# Altium schematic sheet [1] AMS_Input_Stage.SchDoc
size A3
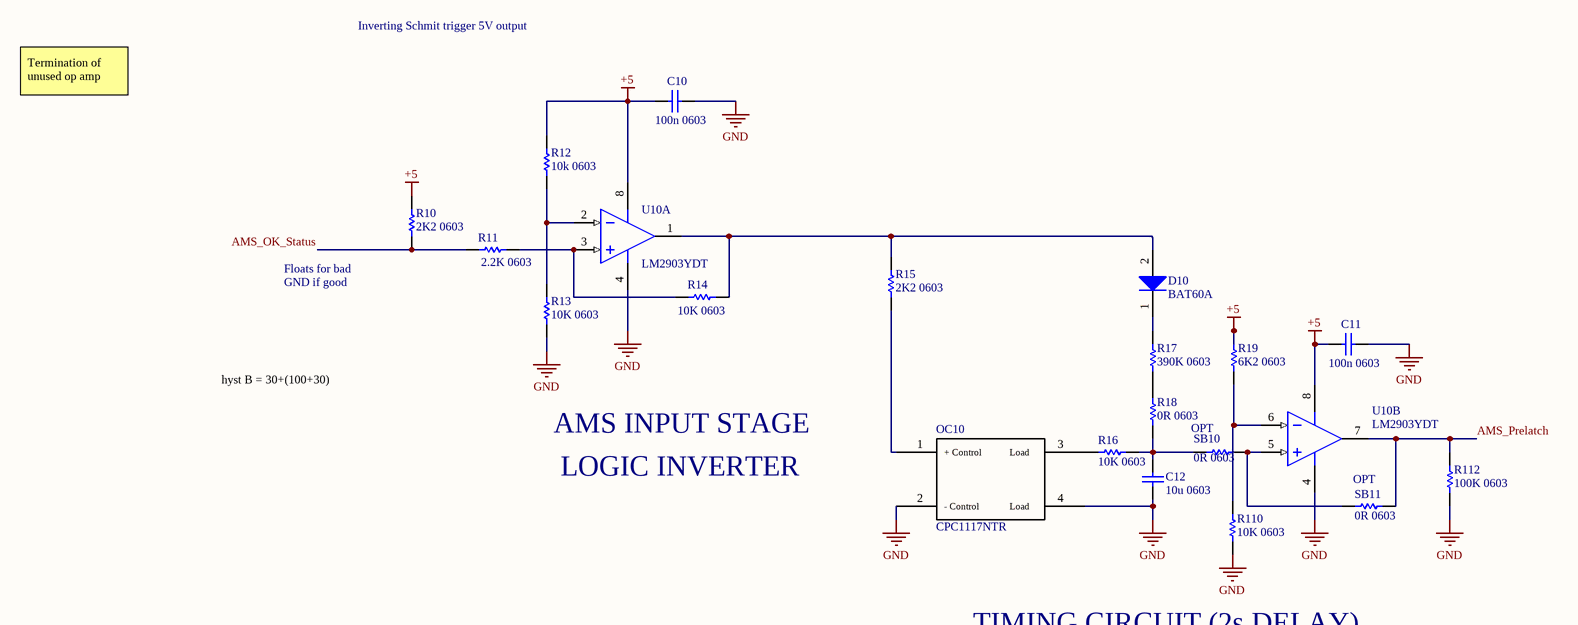
[diagram p0: [1] AMS_Input_Stage.SchDoc]

## Parts
C10  100n 0603  [CAPC0603(1608)100_M]
C11  100n 0603  [CAPC0603(1608)100_M]
C12  10u 0603  [CAPC0603(1608)100_M]
D10  BAT60A  [INF-SOD323_V]
OC10  CPC1117NTR  [SOP-4 (CPC1117NTR)]
R10  2K2 0603  [CAPC0603(1608)100_M]
R11  2.2K 0603  [CAPC0603(1608)100_M]
R12  10k 0603  [CAPC0603(1608)100_M]
R13  10K 0603  [CAPC0603(1608)100_M]
R14  10K 0603  [CAPC0603(1608)100_M]
R15  2K2 0603  [CAPC0603(1608)100_M]
R16  10K 0603  [CAPC0603(1608)100_M]
R17  390K 0603  [CAPC0603(1608)100_M]
R18  0R 0603  [CAPC0603(1608)100_M]
R19  6K2 0603  [CAPC0603(1608)100_M]
R110  10K 0603  [CAPC0603(1608)100_M]
R112  100K 0603  [CAPC0603(1608)100_M]
SB10  0R 0603  [CAPC0603(1608)100_M]
SB11  0R 0603  [CAPC0603(1608)100_M]
U10  LM2903YDT  [ONSC-SOIC-8-751-07_V]  (parts A,B of 2)

## Nets
+5: C10.1 C11.1 R10.1 R12.2 R19.1 U10.8(VCC)
GND: C10.2 C11.2 C12.2 OC10.2 OC10.4 R13.1 R110.2 R112.2 U10.4(GND)
AMS_OK_Status: R10.2 R11.1
AMS_Prelatch: R112.1 SB11.2 U10.7(OUTB)
NetC12_1: C12.1 R16.2 R18.2 SB10.1
NetD10_1: D10.1(K) R17.1
NetD10_2: D10.2(A) R14.2 R15.1 U10.1(OUTA)
NetOC10_1: OC10.1 R15.2
NetOC10_3: OC10.3 R16.1
NetR11_2: R11.2 R14.1 U10.3(INA+)
NetR12_1: R12.1 R13.2 U10.2(INA-)
NetR17_2: R17.2 R18.1
NetR19_2: R19.2 R110.1 U10.6(INB-)
NetSB10_2: SB10.2 SB11.1 U10.5(INB+)

## Notes on the sheet
- Inverting Schmit trigger 5V output
- Termination of unused op amp
- (near R10) Floats for bad
- GND if good
- hyst B = 30+(100+30)
- LOGIC INVERTER
- AMS INPUT STAGE
- (near SB10) OPT
- OPT
- TIMING CIRCUIT (2s DELAY)
- (in symbol CPC1117NTR) + Control; Load; - Control

## Library data of the parts
C10 C11 = Cap: Capacitor; Value: 100nF; Published: 8-Jun-2000; LatestRevisionDate: 17-Jul-2002; LatestRevisionNote: Re-released for DXP Platform.; PackageReference: RAD-0.3; Publisher: Altium Limited; PackageDescription: Radial Cap, Thru-Hole; 2 Leads; 0.3 in Pin Spacing
C12 = Cap: Capacitor; Value: 10uF; Published: 8-Jun-2000; LatestRevisionDate: 17-Jul-2002; LatestRevisionNote: Re-released for DXP Platform.; PackageReference: RAD-0.3; Publisher: Altium Limited; PackageDescription: Radial Cap, Thru-Hole; 2 Leads; 0.3 in Pin Spacing
D10 = CMP-1183-00008-2: Silicon Schottky Diode, -55 to 85 degC, SOD323, Reel, Green; Manufacturer: Infineon; Green: TRUE; VR (max): 10Â V; IF (max): 3,000Â mA; VF (max): 370Â mV; CT (max): 35Â pF; Configuration: Single; PackageDescription: 3-Pin Small Outline Transistor Package, 1.25 x 2 mm Body, 0.65 mm Pitch; PartNumber: BAT60A; Mounting Technology: Surface Mount; PackageReference: SOT323; ComponentLink1Description: Manufacturer URL; Packing: Reel; ComponentLink3URL: http://www.infineon.com/dgdl/SOT323-Package_Overview.pdf?folderId=db3a30431936bc4b0119533e1dcb3c92&fileId=db3a30431936bc4b011953495f283cb1; ComponentLink2URL: http://www.infineon.com/dgdl/bat60aseries.pdf?folderId=db3a304313d846880113def5812204a1&fileId=db3a304313d846880113def70c9304a9; ComponentLink1URL: http://www.infineon.com/; ComponentLink2Description: Datasheet; ComponentLink3Description: Package Specification
R10 R13 R15-R19 R110 R112 = Res1: Resistor; Published: 8-Jun-2000; LatestRevisionDate: 17-Jul-2002; LatestRevisionNote: Re-released for DXP Platform.; PackageReference: AXIAL-0.3; Publisher: Altium Limited; PackageDescription: Axial Device, Thru-Hole; 2 Leads; 0.3 in Pin Spacing
  R10 R15: Value: 2K2
  R13 R16 R110: Value: 10K
  R17: Value: 390K
  R18: Value: 0R
  R19: Value: 6K2
  R112: Value: 100K
R11 = Res1: Resistor; Value: 10K; Published: 8-Jun-2000; LatestRevisionDate: 17-Jul-2002; LatestRevisionNote: Re-released for DXP Platform.; PackageReference: AXIAL-0.3; Publisher: Altium Limited; PackageDescription: Axial Device, Thru-Hole; 2 Leads; 0.3 in Pin Spacing
R12 = Res1: Resistor; Value: 6K2; Published: 8-Jun-2000; LatestRevisionDate: 17-Jul-2002; LatestRevisionNote: Re-released for DXP Platform.; PackageReference: AXIAL-0.3; Publisher: Altium Limited; PackageDescription: Axial Device, Thru-Hole; 2 Leads; 0.3 in Pin Spacing
R14 = Res1: Resistor; Value: 100K; Published: 8-Jun-2000; LatestRevisionDate: 17-Jul-2002; LatestRevisionNote: Re-released for DXP Platform.; PackageReference: AXIAL-0.3; Publisher: Altium Limited; PackageDescription: Axial Device, Thru-Hole; 2 Leads; 0.3 in Pin Spacing
SB10 SB11 = Res1: Resistor; Value: Bridge; Published: 8-Jun-2000; LatestRevisionDate: 17-Jul-2002; LatestRevisionNote: Re-released for DXP Platform.; PackageReference: AXIAL-0.3; Publisher: Altium Limited; PackageDescription: Axial Device, Thru-Hole; 2 Leads; 0.3 in Pin Spacing
U10 = CMP-1305-00052-1: JL 10/9/19: LM2903DR2G model used. / Low Offset Voltage Dual Comparators, 2 to 36 V, -40 to 105 degC, 8-Pin SOIC, Pb-Free, Tape and Reel; Manufacturer: On Semiconductor; VCC Min (V): 2; ICC Typ (mA): 0.4; VCC Max (V): 36; IO Typ (mA): 16; RoHS: TRUE; Mounting Technology: Surface Mount; PackageVersion: Rev. AK, 02/2011; ComponentLink2Description: Datasheet; PackageReference: SOIC-8-751-07; ComponentLink2URL: http://www.onsemi.com/pub_link/Collateral/LM393-D.PDF; ComponentLink1URL: http://www.onsemi.com/; ComponentLink3URL: http://www.onsemi.com/pub_link/Collateral/751-07.PDF; ComponentLink1Description: Manufacturer URL; DatasheetVersion: Rev. 25; PartNumber: LM2903DR2G; Packing: Tape and Reel; ComponentLink3Description: Package Specification; PackageDescription: 8-Pin Small Outline Integrated Circuit, Body 4.9 x 3.9 mm, Pitch 1.27 mm